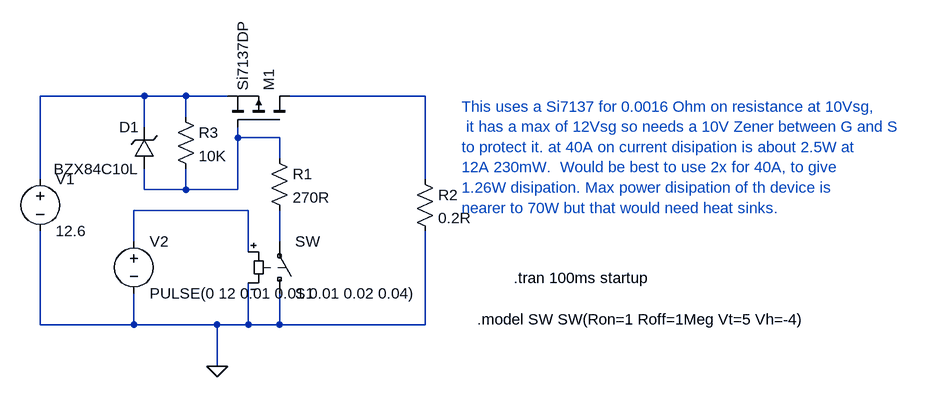
[diagram p0: schematic MosfetSwitchFor12V.asc]
MosfetSwitchFor12V.asc, the LTspice schematic file:
Version 4
SHEET 1 4224 680
WIRE 80 208 -80 208
WIRE 144 208 80 208
WIRE 208 208 144 208
WIRE 512 208 304 208
WIRE 144 240 144 208
WIRE 80 256 80 208
WIRE 224 272 224 256
WIRE 288 272 224 272
WIRE 288 304 288 272
WIRE -80 336 -80 208
WIRE 512 336 512 208
WIRE 80 352 80 320
WIRE 144 352 144 320
WIRE 144 352 80 352
WIRE 224 352 224 272
WIRE 224 352 144 352
WIRE 240 384 64 384
WIRE 64 432 64 384
WIRE 288 432 288 384
WIRE 240 448 240 384
WIRE -80 560 -80 416
WIRE 64 560 64 512
WIRE 64 560 -80 560
WIRE 192 560 64 560
WIRE 240 560 240 496
WIRE 240 560 192 560
WIRE 288 560 288 512
WIRE 288 560 240 560
WIRE 512 560 512 416
WIRE 512 560 288 560
WIRE 192 624 192 560
FLAG 192 624 0
SYMBOL sw 288 528 M180
SYMATTR InstName S1
SYMBOL res 272 288 R0
SYMATTR InstName R1
SYMATTR Value 270R
SYMBOL res 496 320 R0
SYMATTR InstName R2
SYMATTR Value 0.2R
SYMBOL voltage -80 320 R0
SYMATTR InstName V1
SYMATTR Value 12.6
SYMBOL voltage 64 416 R0
SYMATTR InstName V2
SYMATTR Value PULSE(0 12 0.01 0.01 0.01 0.02 0.04)
SYMBOL res 128 224 R0
SYMATTR InstName R3
SYMATTR Value 10K
SYMBOL pmos 304 256 M270
SYMATTR InstName M1
SYMATTR Value Si7137DP
SYMBOL zener 96 320 R180
WINDOW 0 24 64 Left 2
WINDOW 3 24 0 Left 2
SYMATTR InstName D1
SYMATTR Value BZX84C10L
TEXT 592 552 Left 2 !.model SW SW(Ron=1 Roff=1Meg Vt=5 Vh=-4)
TEXT 648 488 Left 2 !.tran 100ms startup
TEXT 568 224 Left 2 ;This uses a Si7137 for 0.0016 Ohm on resistance at 10Vsg,\n it has a max of 12Vsg so needs a 10V Zener between G and S \nto protect it. at 40A on current disipation is about 2.5W at \n12A 230mW.  Would be best to use 2x for 40A, to give \n1.26W disipation. Max power disipation of th device is \nnearer to 70W but that would need heat sinks.

The netlist it stands for:
* MosfetSwitchFor12V.asc
S1 0 N005 N004 0 SW
R1 N003 N005 270R
R2 N002 0 0.2R
V1 N001 0 12.6
V2 N004 0 PULSE(0 12 0.01 0.01 0.01 0.02 0.04)
R3 N001 N003 10K
M1 N002 N003 N001 N001 Si7137DP
D1 N003 N001 BZX84C10L
.model D D
.lib standard.dio
.model NMOS NMOS
.model PMOS PMOS
.lib standard.mos
.model SW SW(Ron=1 Roff=1Meg Vt=5 Vh=-4)
.tran 100ms startup
* This uses a Si7137 for 0.0016 Ohm on resistance at 10Vsg,
*  it has a max of 12Vsg so needs a 10V Zener between G and S
* to protect it. at 40A on current disipation is about 2.5W at
* 12A 230mW.  Would be best to use 2x for 40A, to give
* 1.26W disipation. Max power disipation of th device is
* nearer to 70W but that would need heat sinks.
.backanno
.end